# Altium schematic sheet 00-History.SchDoc
size A4; Organization: ORGANIZATION; Address1: ADDRESS 1; Address2: ADDRESS 2; Address3: ADDRESS 3; Address4: ADDRESS 4; SheetNumber: 1; SheetTotal: 5; ENG_APP_DATE: --/--/--; DSN_APP_DATE: --/--/--; CHK_APP_DATE: --/--/--
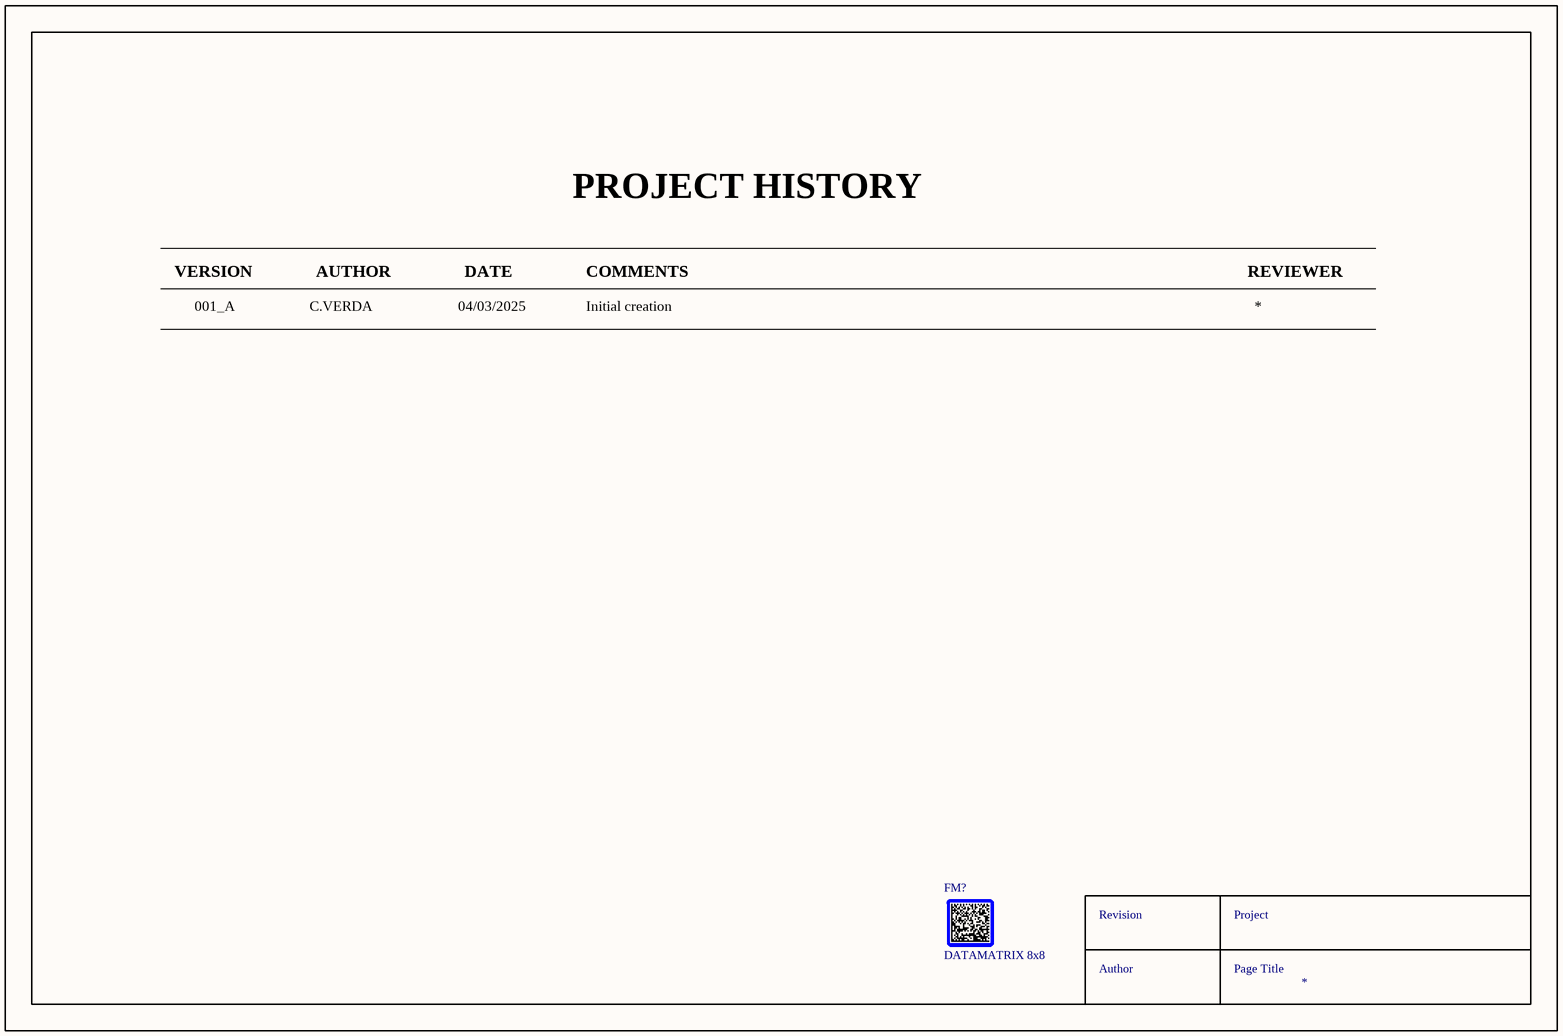
[diagram p0: 00-History.SchDoc]

## Parts
FM?  DATAMATRIX 8x8  [DATAMATRIX 8x8]

## Notes on the sheet
- PROJECT HISTORY
- VERSION
- 001_A
- C.VERDA
- AUTHOR
- 04/03/2025
- DATE
- COMMENTS
- Initial creation
- REVIEWER
- *
- Revision
- Project
- Author
- Page Title

## Library data of the parts
FM? = CMP-00030-00003-2: DataMatrix BMS 8x8mm